# Altium schematic sheet PowerDesignAD.schdoc
size A3; Symbol: Sheet-Symbol_A4; Device: Sheet-Symbol_A4; @Project Name: Lm317 powerDesign; @Page Count: 1; @Update Date: 2024-03-28; @Create Date: 2024-03-27; @Schematic Name: Schematic1; @Page No: 1; @Page Name: P1; Company: 嘉立创EDA; Page Size: A4; Version: V1.0
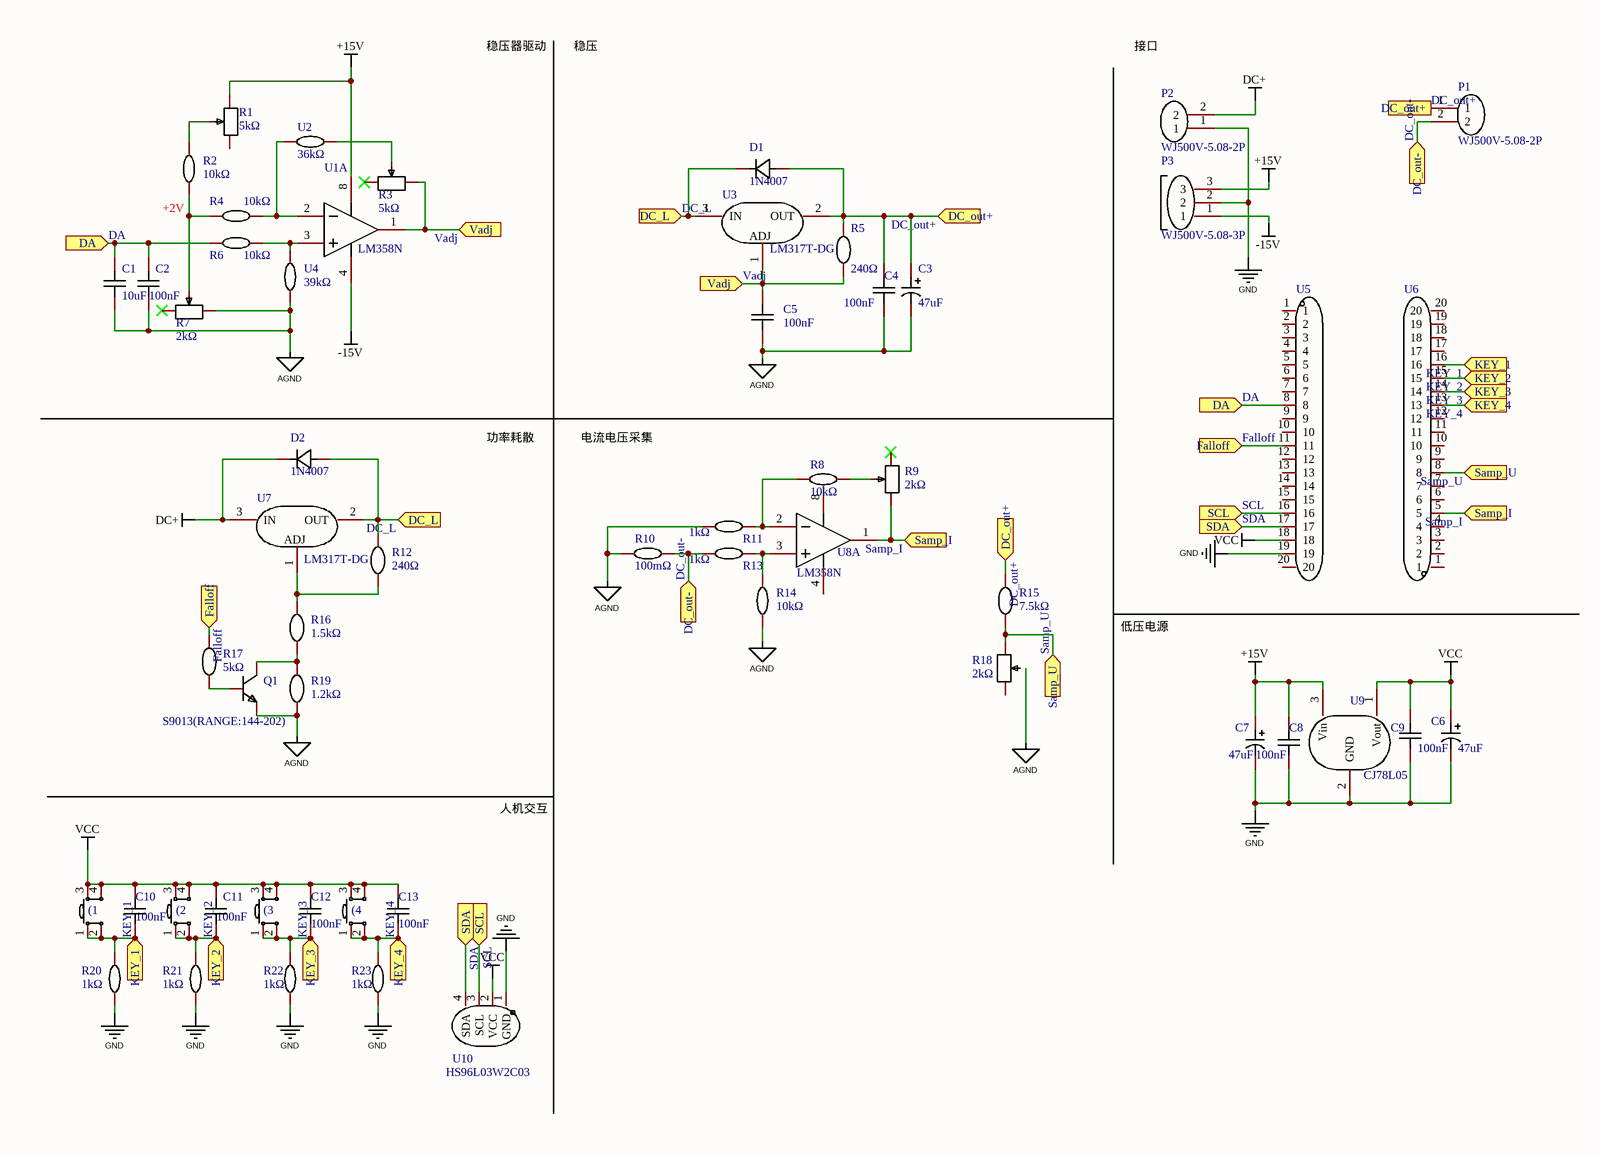
[diagram p0: PowerDesignAD.schdoc]

## Parts
(1  Key_TH_6x6x6  [SW-TH_4P-L6.0-W6.0-P4.50-LS6.5]  (value not drawn)
(2  Key_TH_6x6x6  [SW-TH_4P-L6.0-W6.0-P4.50-LS6.5]  (value not drawn)
(3  Key_TH_6x6x6  [SW-TH_4P-L6.0-W6.0-P4.50-LS6.5]  (value not drawn)
(4  Key_TH_6x6x6  [SW-TH_4P-L6.0-W6.0-P4.50-LS6.5]  (value not drawn)
C1  10uF  [CAP-TH_L5.5-W3.8-P3.50-D0.6]
C2  100nF  [CAP-TH_L5.0-W2.5-P5.08-D0.7]
C3  47uF  [CAP-TH_BD6.3-P3.50-D0.5-FD]
C4  100nF  [CAP-TH_L13.0-W6.0-P10.00-D0.6]
C5  100nF  [CAP-TH_L5.0-W2.5-P5.08-D0.7]
C6  47uF  [CAP-TH_BD6.3-P3.50-D0.5-FD]
C7  47uF  [CAP-TH_BD6.3-P3.50-D0.5-FD]
C8  100nF  [CAP-TH_L5.0-W2.5-P5.08-D0.7]
C9  100nF  [CAP-TH_L5.0-W2.5-P5.08-D0.7]
C10  100nF  [CAP-TH_L5.0-W2.5-P5.08-D0.7]
C11  100nF  [CAP-TH_L5.0-W2.5-P5.08-D0.7]
C12  100nF  [CAP-TH_L5.0-W2.5-P5.08-D0.7]
C13  100nF  [CAP-TH_L5.0-W2.5-P5.08-D0.7]
D1  1N4007  [DO-41_BD2.4-L4.7-P8.70-D0.8-RD]
D2  1N4007  [DO-41_BD2.4-L4.7-P8.70-D0.8-RD]
P1  WJ500V-5.08-2P  [CONN-TH_2P-P5.00_WJ500V-5.08-2P]
P2  WJ500V-5.08-2P  [CONN-TH_2P-P5.00_WJ500V-5.08-2P]
P3  WJ500V-5.08-3P  [CONN-TH_3P-P5.00_WJ500V-5.08-3P]
Q1  S9013(RANGE:144-202)  [TO-92-3_L4.9-W3.7-P1.27-L]
R1  5kΩ  [RES-ADJ-TH_3296W]
R2  10kΩ  [RES-TH_BD2.4-L6.3-P10.30-D0.6]
R3  5kΩ  [RES-ADJ-TH_3296W]
R4  10kΩ  [RES-TH_BD2.4-L6.3-P10.30-D0.6]
R5  240Ω  [RES-TH_BD3.5-L9.0-P13.00-D0.5]
R6  10kΩ  [RES-TH_BD2.4-L6.3-P10.30-D0.6]
R7  2kΩ  [RES-ADJ-TH_3296W]
R8  10kΩ  [RES-TH_BD2.4-L6.3-P10.30-D0.6]
R9  2kΩ  [RES-ADJ-TH_3296W]
R10  100mΩ  [R2512]
R11  1kΩ  [RES-TH_BD2.5-L6.5-P10.50-D0.6]
R12  240Ω  [RES-TH_BD3.5-L9.0-P13.00-D0.5]
R13  1kΩ  [RES-TH_BD2.5-L6.5-P10.50-D0.6]
R14  10kΩ  [RES-TH_BD2.4-L6.3-P10.30-D0.6]
R15  7.5kΩ  [RES-TH_BD2.3-L6.5-P10.50-D0.5]
R16  1.5kΩ  [RES-TH_BD2.7-L6.2-P10.20-D0.4]
R17  5kΩ  [RES-TH_BD4.5-L11.5-P15.50-D0.8]
R18  2kΩ  [RES-ADJ-TH_3296W]
R19  1.2kΩ  [RES-TH_BD2.3-L6.5-P10.50-D0.5]
R20  1kΩ  [RES-TH_BD2.5-L6.5-P10.50-D0.6]
R21  1kΩ  [RES-TH_BD2.5-L6.5-P10.50-D0.6]
R22  1kΩ  [RES-TH_BD2.5-L6.5-P10.50-D0.6]
R23  1kΩ  [RES-TH_BD2.5-L6.5-P10.50-D0.6]
U1  LM358N  [DIP-8_L9.2-W6.3-P2.54-LS7.62-BL]  (part A of 2)
U2  36kΩ  [RES-TH_BD2.7-L6.2-P10.20-D0.4]
U3  LM317T-DG  [TO-220-3_L10.0-W4.5-P2.54-L]
U4  39kΩ  [RES-TH_BD2.7-L6.2-P10.20-D0.4]
U5  PM254-1-20-Z-8.5  [HDR-TH_20P-P2.54-V-F-2]  (value not drawn)
U6  PM254-1-20-Z-8.5  [HDR-TH_20P-P2.54-V-F-2]  (value not drawn)
U7  LM317T-DG  [TO-220-3_L10.0-W4.5-P2.54-L]
U8  LM358N  [DIP-8_L9.2-W6.3-P2.54-LS7.62-BL]  (part A of 2)
U9  CJ78L05  [TO-92-3_L4.9-W3.7-P1.27-L]
U10  HS96L03W2C03  [OLED-TH_L27.8-W27.2-P2.54_C9900033791]

## Ports
DA (in), DC_L (in), DC_out+ (in), DC_out- (in), Falloff (in), KEY_1 (in), KEY_2 (in), KEY_3 (in), KEY_4 (in), Samp_I (in), Samp_U (in), SCL (in), SDA (in), Vadj (in)

## Nets
+15V: C7.1 C8.2 P3.3 R1.1 U1.8(VCC) U9.3(Vin)
-15V: P3.1 U1.4(GND)
AGND: C1.2 C2.1 C3.2 C4.1 C5.1 Q1.1(E) R7.3 R10.1 R11.1 R14.1 R19.1 U4.1
DC+: D2.1(K) P2.2 U7.3(IN)
GND: C6.2 C7.2 C8.1 C9.1 P2.1 P3.2 R20.1 R21.1 R22.1 R23.1 U5.19 U9.2(GND) U10.1(GND)
VCC: (1.3 (1.4 (2.3 (2.4 (3.3 (3.4 (4.3 (4.4 C6.1 C9.2 C10.2 C11.2 C12.2 C13.2 U5.18 U9.1(Vout) U10.2(VCC)
DA: C1.1 C2.2 R6.1 U5.8 ; port DA
DC_L: D1.1(K) D2.2(A) R12.2 U3.3(IN) U7.2(OUT) ; port DC_L
DC_out+: C3.1 C4.2 D1.2(A) P1.1 R5.2 R15.2 U3.2(OUT) ; port DC_out+
DC_out-: P1.2 R10.2 R13.1 ; port DC_out-
Falloff: R17.2 U5.11 ; port Falloff
KEY_1: (1.1 (1.2 C10.1 R20.2 U6.16 ; port KEY_1
KEY_2: (2.1 (2.2 C11.1 R21.2 U6.15 ; port KEY_2
KEY_3: (3.1 (3.2 C12.1 R22.2 U6.14 ; port KEY_3
KEY_4: (4.1 (4.2 C13.1 R23.2 U6.13 ; port KEY_4
Samp_I: R9.3 U6.5 U8.1(OUT1) ; port Samp_I
Samp_U: R15.1 R18.3 U6.8 ; port Samp_U
SCL: U5.16 U10.3(SCL) ; port SCL
SDA: U5.17 U10.4(SDA) ; port SDA
Vadj: C5.2 R3.1 R5.1 U1.1(OUT1) U3.1(ADJ) ; port Vadj
NetQ1_2: Q1.2(B) R17.1
NetQ1_3: Q1.3(C) R16.1 R19.2
NetR1_2: R1.2 R2.1
NetR2_2: R2.2 R4.1 R7.2
NetR3_2: R3.2 U2.2
NetR4_2: R4.2 U1.2(IN1-) U2.1
NetR6_2: R6.2 U1.3(IN1+) U4.2
NetR8_1: R8.1 R9.2
NetR8_2: R8.2 R11.2 U8.2(IN1-)
NetR12_1: R12.1 R16.2 U7.1(ADJ)
NetR13_2: R13.2 R14.2 U8.3(IN1+)

Not connected (* = marked no-connect by the designer): R1 3; R3 3*; R7 1*; R9 1*; R18 1 2; U5 1 2 3 4 5 6 7 9 10 12 13 14 15 20; U6 1 2 3 4 6 7 9 10 11 12 17 18 19 20; U8 4(GND) 8(VCC)

## Notes on the sheet
- 稳压器驱动
- 稳压
- 接口
- (near R2) +2V
- 功率耗散
- 电流电压采集
- 低压电源
- 人机交互
- Title
- Size:
- Date:
- A3
- Number:
- Time:
- Revision:
- Sheet
- of
- File:

## Library data of the parts
(1-(4 = Key_TH_6x6x6: Symbol: 轻触按键; Convert to PCB: yes; Device: Key_TH_6x6x6; Add into BOM: yes; Supplier Part: C2837516; Supplier Footprint: 插件
C1 = CD1E106MC9BER2F100: Manufacturer: Dersonic(德尔创); Add into BOM: yes; Tolerance: ±20%; Voltage Rated: 25V; Temperature Coefficient: X5R; Name: 10uF; Symbol: CD1E106MC9BER2F100; Device: CD1E106MC9BER2F100; Supplier: LCSC; Supplier Part: C2761733; Manufacturer Part: CD1E106MC9BER2F100; Value: 10uF; JLCPCB Part Class: 扩展库; LCSC Part Name: 10uF ±20% 25V; Supplier Footprint: 插件,P=5.08mm; Datasheet: https://atta.szlcsc.com/upload/public/pdf/source/20210512/C2761733_48A4F8FFA54EF14BEC181E01EC41507A.pdf; Convert to PCB: yes
C2 C5 C8-C13 = CC2A104ZC1ID3F7C30MF: Manufacturer: Dersonic(德尔创); Add into BOM: yes; Tolerance: -20%~+80%; Voltage Rated: 100V; Temperature Coefficient: Y5V; φD: 7mm; Body Thickness: 2.2mm; Name: 100nF; Symbol: CC2A104ZC1ID3F7C30MF; Device: CC2A104ZC1ID3F7C30MF; Supplier: LCSC; Supplier Part: C254109; Manufacturer Part: CC2A104ZC1ID3F7C30MF; Value: 100nF; JLCPCB Part Class: 扩展库; LCSC Part Name: 100nF -20%~+80% 100V; Supplier Footprint: 插件,P=5.08mm; Datasheet: https://atta.szlcsc.com/upload/public/pdf/source/20200826/C254109_69B66F26D881BAFE780345BC7E166D34.pdf; Convert to PCB: yes; Lead Spacing: 5.08mm
C3 C6 C7 = 03EC0571: Manufacturer: KNSCHA(科尼盛); Add into BOM: yes; Tolerance: ±20%; Rated Voltage: 50V; Ripple Current: 180mA@100kHz; φD: 6.3mm; L: 12mm; Lifetime @ Temp: 2000hrs@105℃; Name: 47uF; Symbol: 03EC0571; Device: 03EC0571; Supplier: LCSC; Supplier Part: C2831773; Manufacturer Part: 03EC0571; Value: 47uF; JLCPCB Part Class: 扩展库; LCSC Part Name: 47uF ±20% 50V; Supplier Footprint: 插件,D6.3xL12mm; Datasheet: https://atta.szlcsc.com/upload/public/pdf/source/20210511/C2831773_B2DD61C1D939670FA320BC15BC6C3610.pdf; Convert to PCB: yes; Equivalent Series Resistance(ESR): -; Lead Spacing: 3.5mm; Operating Temperature: -40℃~+105℃
C4 = MPX104K31C3KN15600: Manufacturer: KNSCHA(科尼盛); Add into BOM: yes; Tolerance: ±10%; Voltage(AC): 275V；310V；305V; Subclass: X2; safety certification: UL；CUL；KC；ENEC；VDE；CQC; Name: 100nF; Symbol: MPX104K31C3KN15600; Device: MPX104K31C3KN15600; LCSC Part Name: 100nF ±10% 275V 305V 310V 等级:X2; Supplier Part: C489079; Manufacturer Part: MPX104K31C3KN15600; Supplier Footprint: 插件,P=10mm; JLCPCB Part Class: 扩展库; Datasheet: https://atta.szlcsc.com/upload/public/pdf/source/20200225/C489079_75CB6A5338414DC85C4C6073302579B5.pdf; Supplier: LCSC; Convert to PCB: yes; Value: 100nF; Operating Temperature: -40℃~+110℃
D1 D2 = 1N4007_C2985028: Manufacturer: GOODWORK(固得沃克); Add into BOM: yes; Forward Voltage (Vf@If): 1V@1A; Reverse Voltage (Vr): 1kV; Average Rectified Current (Io): 1A; Name: 1N4007; Symbol: 1N4007_C2985028; Device: 1N4007_C2985028; Supplier: LCSC; Supplier Part: C2985028; Manufacturer Part: 1N4007; JLCPCB Part Class: 扩展库; LCSC Part Name: 电压:1kV 电流:1A; Supplier Footprint: DO-41; Datasheet: https://atta.szlcsc.com/upload/public/pdf/source/20210723/C2848669_ECFE0BC1B34B7BAAA686846FF0F306A7.pdf; Convert to PCB: yes
P1 P2 = WJ500V-5.08-2P: Manufacturer: KANGNEX(康奈克斯电气); Symbol: WJ500V-5.08-2P-14-00A; Add into BOM: yes; Structure: 1x2P; Pitch: 5.08mm; Current Rating (Max): 18A; Voltage Rating (Max): 250V; Wire Gauge - AWG: 14~30; Wire Gauge - mm2: 2.5; Number of PINs Per Row: 2; Name: WJ500V-5.08-2P; Device: WJ500V-5.08-2P; Supplier: LCSC; Manufacturer Part: WJ500V-5.08-2P; Supplier Part: C8465; JLCPCB Part Class: 扩展库; LCSC Part Name: 5.08mm 1x2P 排数:1 每排P数:2 直插; Supplier Footprint: 插件,P=5.08mm; Datasheet: https://atta.szlcsc.com/upload/public/pdf/source/20191225/C8465_02D34CE5B5B4A53DF5891601D97FA9F4.pdf; Convert to PCB: yes; Color: 绿色; Mounting Style: 直插; Number of Pins: 2P; Number of Rows: 1; Operating Temperature Range: -40℃~+105℃
P3 = WJ500V-5.08-3P: Manufacturer: KANGNEX(康奈克斯电气); Symbol: WJ500V-5.08-3P-14-00A; Add into BOM: yes; Structure: 1x3P; Pitch: 5.08mm; Current Rating (Max): 18A; Voltage Rating (Max): 250V; Wire Gauge - AWG: 14~30; Wire Gauge - mm2: 2.5; Number of PINs Per Row: 3; Name: WJ500V-5.08-3P; Device: WJ500V-5.08-3P; Supplier: LCSC; Manufacturer Part: WJ500V-5.08-3P; Supplier Part: C72334; JLCPCB Part Class: 扩展库; LCSC Part Name: 5.08mm 1x3P 排数:1 每排P数:3 直插; Supplier Footprint: 插件,P=5.08mm; Datasheet: https://atta.szlcsc.com/upload/public/pdf/source/20191225/C72334_8A5EF831D67650233B6B1E3F2BC06274.pdf; Convert to PCB: yes; Color: 绿色; Mounting Style: 直插; Number of Pins: 3P; Number of Rows: 1; Operating Temperature Range: -40℃~+105℃
Q1 = S9013(RANGE:144-202): Manufacturer: CJ(江苏长电/长晶); Symbol: S9013_C16066; Add into BOM: yes; Transistor Type: NPN; Collector Current (Ic): 500mA; Collector-Emitter Breakdown Voltage (Vceo): 25V; Power Dissipation (Pd): 625mW; Name: S9013(RANGE:144-202); Device: S9013(RANGE:144-202); LCSC Part Name: 耐压:25V 电流:500mA NPN H档; Supplier Part: C16066; Manufacturer Part: S9013(RANGE:144-202); Supplier Footprint: TO-92-3; JLCPCB Part Class: 扩展库; Datasheet: https://atta.szlcsc.com/upload/public/pdf/source/20130730/1457706627832.pdf; Supplier: LCSC; Convert to PCB: yes
R1 R3 = 3296W-1-502LF: Manufacturer: BOURNS; Add into BOM: yes; Tolerance: ±10%; Name: 5kΩ; Symbol: 3296W-1-502LF; Device: 3296W-1-502LF; LCSC Part Name: 5kΩ ±10%; Supplier Part: C60620; Manufacturer Part: 3296W-1-502LF; Supplier Footprint: 插件; JLCPCB Part Class: 扩展库; Datasheet: https://atta.szlcsc.com/upload/public/pdf/source/20180326/C111793_7BE3639881F18EA7BF3D269EDA80A489.pdf; Supplier: LCSC; Convert to PCB: yes; Value: 5kΩ
R2 R4 R6 R8 R14 = MFR-25FTE52-10K: Manufacturer: YAGEO(国巨); Add into BOM: yes; Tolerance: ±1%; Power(Watts): 250mW; Temperature Coefficient: ±50ppm/℃; Name: 10kΩ; Symbol: MFR-25FTE52-10K; Device: MFR-25FTE52-10K; LCSC Part Name: 金属膜电阻 10kΩ ±1% 250mW; Supplier Part: C172967; Manufacturer Part: MFR-25FTE52-10K; Supplier Footprint: 插件,D2.4xL6.3mm; JLCPCB Part Class: 扩展库; Datasheet: https://atta.szlcsc.com/upload/public/pdf/source/20191118/C457825_18355E864DE4965678DC27B0EBC3E21E.pdf; Supplier: LCSC; Convert to PCB: yes; Type: 金属膜电阻; Value: 10kΩ; Operating Temperature Range: -55℃~+155℃
R5 R12 = CR1/2WS-240Ω±5%-ST52: Manufacturer: VO(翔胜); Add into BOM: yes; Tolerance: ±5%; Overload Voltage (Max): 350V; Power(Watts): 500mW; Temperature Coefficient: ±350ppm/℃; Name: 240Ω; Symbol: CR1/2WS-240Ω±5%-ST52; Device: CR1/2WS-240Ω±5%-ST52; LCSC Part Name: 碳膜电阻 240Ω ±5% 500mW; Supplier Part: C2894644; Manufacturer Part: CR1/2WS-240Ω±5%-ST52; Supplier Footprint: 插件,D2.7xL6.2mm; JLCPCB Part Class: 扩展库; Datasheet: https://atta.szlcsc.com/upload/public/pdf/source/20210803/C2857407_45FF53FE186CAB545115AD37303966CD.pdf; Supplier: LCSC; Convert to PCB: yes; Type: 碳膜电阻; Value: 240Ω; Operating Temperature Range: -55℃~+155℃
R7 R9 R18 = 3296W-1-202LF: Manufacturer: BOURNS; Symbol: 3296W-1-202LF_C83684; Add into BOM: yes; Tolerance: ±10%; Name: 2kΩ; Device: 3296W-1-202LF; LCSC Part Name: 2kΩ ±10%; Supplier Part: C83684; Manufacturer Part: 3296W-1-202LF; Supplier Footprint: 插件; JLCPCB Part Class: 扩展库; Datasheet: https://atta.szlcsc.com/upload/public/pdf/source/20180326/C111793_7BE3639881F18EA7BF3D269EDA80A489.pdf; Supplier: LCSC; Convert to PCB: yes; Value: 2kΩ
R10 = RLP25FEER100: Manufacturer: 大毅科技; Add into BOM: yes; Tolerance: ±1%; Power(Watts): 2W; Temperature Coefficient: ±50ppm/℃; Name: 100mΩ; Symbol: RLP25FEER100; Device: RLP25FEER100; LCSC Part Name: 100mΩ ±1% 2W; Supplier Part: C160587; Manufacturer Part: RLP25FEER100; Supplier Footprint: 2512; JLCPCB Part Class: 扩展库; Datasheet: https://atta.szlcsc.com/upload/public/pdf/source/20191209/C467441_D59F70B0A5C6980F35DB1CB3CCA97CC4.pdf; Supplier: LCSC; Convert to PCB: yes; Value: 100mΩ
R11 R13 R20-R23 = MFR0W4F1001A50: Manufacturer: UNI-ROYAL(厚声); Add into BOM: yes; Tolerance: ±1%; Overload Voltage (Max): 250V; Power(Watts): 250mW; Temperature Coefficient: ±50ppm/℃; Name: 1kΩ; Symbol: MFR0W4F1001A50; Device: MFR0W4F1001A50; Supplier: LCSC; Manufacturer Part: MFR0W4F1001A50; Supplier Part: C57435; Value: 1kΩ; JLCPCB Part Class: 扩展库; LCSC Part Name: 1kΩ ±1% 250mW 金属膜电阻; Supplier Footprint: 插件; Datasheet: https://atta.szlcsc.com/upload/public/pdf/source/20191012/C436293_8820AA14BC71FA35E551C06C441482A0.pdf; Convert to PCB: yes; Type: 金属膜电阻
R15 = RN1/2WS7.5KΩFT/BA1: Manufacturer: Tyohm(幸亚电阻); Add into BOM: yes; Tolerance: ±1%; Power(Watts): 500mW; Temperature Coefficient: ±50ppm/℃; Name: 7.5kΩ; Symbol: RN1/2WS7.5KΩFT/BA1; Device: RN1/2WS7.5KΩFT/BA1; Supplier: LCSC; Supplier Part: C385543; Manufacturer Part: RN1/2WS7.5KΩFT/BA1; Value: 7.5kΩ; JLCPCB Part Class: 扩展库; LCSC Part Name: 7.5kΩ ±1% 500mW 金属膜电阻; Supplier Footprint: 插件; Datasheet: https://atta.szlcsc.com/upload/public/pdf/source/20191008/C433681_B72693A7FD256E0D1DC5EFE3F095EED3.pdf; Convert to PCB: yes; Type: 金属膜电阻
R16 = CR1/4W-1K5±5%-ST52: Manufacturer: VO(翔胜); Add into BOM: yes; Tolerance: ±5%; Overload Voltage (Max): 250V; Power(Watts): 250mW; Temperature Coefficient: ±350ppm/℃; Name: 1.5kΩ; Symbol: CR1/4W-1K5±5%-ST52; Device: CR1/4W-1K5±5%-ST52; LCSC Part Name: 碳膜电阻 1.5kΩ ±5% 250mW; Supplier Part: C2894662; Manufacturer Part: CR1/4W-1K5±5%-ST52; Supplier Footprint: 插件,2.7x6.2mm; JLCPCB Part Class: 扩展库; Datasheet: https://atta.szlcsc.com/upload/public/pdf/source/20210803/C2857407_45FF53FE186CAB545115AD37303966CD.pdf; Supplier: LCSC; Convert to PCB: yes; Type: 碳膜电阻; Value: 1.5kΩ; Operating Temperature Range: -55℃~+155℃
R17 = MFR100FTE73-5K: Manufacturer: YAGEO(国巨); Add into BOM: yes; Tolerance: ±1%; Power(Watts): 1W; Temperature Coefficient: ±50ppm/℃; Name: 5kΩ; Symbol: MFR100FTE73-5K; Device: MFR100FTE73-5K; LCSC Part Name: 金属膜电阻 5kΩ ±1% 1W; Supplier Part: C2838701; Manufacturer Part: MFR100FTE73-5K; Supplier Footprint: 插件,4.5x11.5mm; JLCPCB Part Class: 扩展库; Datasheet: https://atta.szlcsc.com/upload/public/pdf/source/20220113/6D33C91FDFACEAAC0A62ED46CF46C6E2.pdf; Supplier: LCSC; Convert to PCB: yes; Type: 金属膜电阻; Value: 5kΩ; Operating Temperature Range: -55℃~+155℃
R19 = MF1/4W-1.2KΩ±1%T52: Manufacturer: 华星机电; Add into BOM: yes; Tolerance: ±1%; Power(Watts): 250mW; Temperature Coefficient: ±200ppm/℃; Name: 1.2kΩ; Symbol: MF1/4W-1.2KΩ±1%T52; Device: MF1/4W-1.2KΩ±1%T52; LCSC Part Name: 金属膜电阻 1.2kΩ ±1% 250mW; Supplier Part: C713998; Manufacturer Part: MF1/4W-1.2KΩ±1%T52; Supplier Footprint: 插件; JLCPCB Part Class: 扩展库; Datasheet: https://atta.szlcsc.com/upload/public/pdf/source/20200731/C713882_AE8EB1102749D7E4FB4FB13DC898C429.pdf; Supplier: LCSC; Convert to PCB: yes; Type: 金属膜电阻; Value: 1.2kΩ
U1 U8 = LM358N: Manufacturer: HGSEMI(华冠); Symbol: LM358N_C434570; Add into BOM: yes; Name: LM358N; Device: LM358N; LCSC Part Name: LM358N; Supplier Part: C434570; Manufacturer Part: LM358N; Supplier Footprint: DIP-8; JLCPCB Part Class: 扩展库; Datasheet: https://atta.szlcsc.com/upload/public/pdf/source/20201104/C398078_C03AD53C2769C23315C184712D62478F.pdf; Supplier: LCSC; Convert to PCB: yes; Number of Circuits: -
U2 = MF1/4W-36K±1%-ST52: Manufacturer: VO(翔胜); Add into BOM: yes; Tolerance: ±1%; Overload Voltage (Max): 250V; Power(Watts): 250mW; Temperature Coefficient: ±350ppm/℃; Name: 36kΩ; Symbol: MF1/4W-36K±1%-ST52; Device: MF1/4W-36K±1%-ST52; Supplier: LCSC; Supplier Part: C2848587; Manufacturer Part: MF1/4W-36K±1%-ST52; Value: 36kΩ; JLCPCB Part Class: 扩展库; LCSC Part Name: 金属膜电阻 36kΩ ±1% 250mW; Supplier Footprint: 插件,2.7x6.2mm; Convert to PCB: yes; Type: 金属膜电阻; Operating Temperature Range: -55℃~+155℃
U3 U7 = LM317T-DG: Manufacturer: ST(意法半导体); Add into BOM: yes; Output Type: 可调; Maximum Input Voltage: 40V; Output Voltage: 1.2V~37V; MAX Output Current: 1.5A; Power Supply Rejection Ratio (PSRR): 80dB@(120Hz); standby current: 10mA; Output Polarity: 正极; Number of Outputs: 1; Name: LM317T-DG; Symbol: LM317T-DG; Device: LM317T-DG; LCSC Part Name: ADJ 输入40V 输出1.2V~37V 1.5A; Supplier Part: C18718; Manufacturer Part: LM317T-DG; Supplier Footprint: TO-220; JLCPCB Part Class: 扩展库; Datasheet: https://atta.szlcsc.com/upload/public/pdf/source/20131225/1457706663965.pdf; Supplier: LCSC; Convert to PCB: yes; Dropout Voltage: -; Operating Temperature: 0℃~+125℃
U4 = CR1/4W-39K±5%-ST26: Manufacturer: VO(翔胜); Add into BOM: yes; Tolerance: ±5%; Overload Voltage (Max): 250V; Power(Watts): 250mW; Temperature Coefficient: ±350ppm/℃; Name: 39kΩ; Symbol: CR1/4W-39K±5%-ST26; Device: CR1/4W-39K±5%-ST26; LCSC Part Name: 碳膜电阻 39kΩ ±5% 250mW; Supplier Part: C2894635; Manufacturer Part: CR1/4W-39K±5%-ST26; Supplier Footprint: 插件,2.7x6.2mm; JLCPCB Part Class: 扩展库; Datasheet: https://atta.szlcsc.com/upload/public/pdf/source/20210803/C2857407_45FF53FE186CAB545115AD37303966CD.pdf; Supplier: LCSC; Convert to PCB: yes; Type: 碳膜电阻; Value: 39kΩ; Operating Temperature Range: -55℃~+155℃
U5 U6 = PM254-1-20-Z-8.5: Manufacturer: HCTL(华灿天禄); Add into BOM: yes; Holes Structure: 1x20P; Pitch: 2.54mm; Circular Hole / Square Hole: 方孔; Number of Holes: 20P; Current Rating (Max): 3A; Holes Direction: 顶部; Soldering Temperature(Max): 260℃@5S; Symbol: PM254-1-20-Z-8.5; Device: PM254-1-20-Z-8.5; LCSC Part Name: 1x20P 间距:2.54mm 直插; Supplier Part: C2897383; Manufacturer Part: PM254-1-20-Z-8.5; Supplier Footprint: 插件,P=2.54mm; JLCPCB Part Class: 扩展库; Datasheet: https://atta.szlcsc.com/upload/public/pdf/source/20230609/534BE42964C679BDE98E061007C4ABD6.pdf; Supplier: LCSC; Convert to PCB: yes; Row Spacing: -; Mounting Type: 直插; Number of Rows: 单排; Voltage Rating (Max): -; Insulation Height: 8.5mm; Contact Material: 铜合金; Operating Temperature Range: -40℃~+105℃
U9 = CJ78L05_C8608: Manufacturer: CJ(江苏长电/长晶); Symbol: CJ78L05 5V TO-92; Add into BOM: yes; Output Type: 固定; Maximum Input Voltage: 30V; Output Voltage: 5V; MAX Output Current: 100mA; Dropout Voltage: 1.7V@(40mA); Output Polarity: 正极; Number of Outputs: 1; Name: CJ78L05; Device: CJ78L05_C8608; LCSC Part Name: 输入30V 输出5V 100mA; Supplier Part: C8608; Manufacturer Part: CJ78L05; Supplier Footprint: TO-92-3; JLCPCB Part Class: 扩展库; Datasheet: https://atta.szlcsc.com/upload/public/pdf/source/20140809/1457707216307.pdf; Supplier: LCSC; Convert to PCB: yes
U10 = HS96L03W2C03: Manufacturer: HS(汉昇); Add into BOM: yes; Main Control Chip: SSD1315; Interface Type: I2C; Pixel Resolution: 128x64; Name: HS96L03W2C03; Symbol: HS96L03W2C03; Device: HS96L03W2C03; LCSC Part Name: 0.96寸OLED显示屏窄白光IIC; Supplier Part: C5248080; Manufacturer Part: HS96L03W2C03; Supplier Footprint: -; JLCPCB Part Class: 扩展库; Datasheet: https://atta.szlcsc.com/upload/public/pdf/source/20230627/763D01F79A90007632F098068C7C8AD9.pdf; Supplier: LCSC; Convert to PCB: yes; Size: 0.96; Operating Temperature: -40℃~+70℃